# Altium project cansat_single_pair_ethernet.PrjPcb
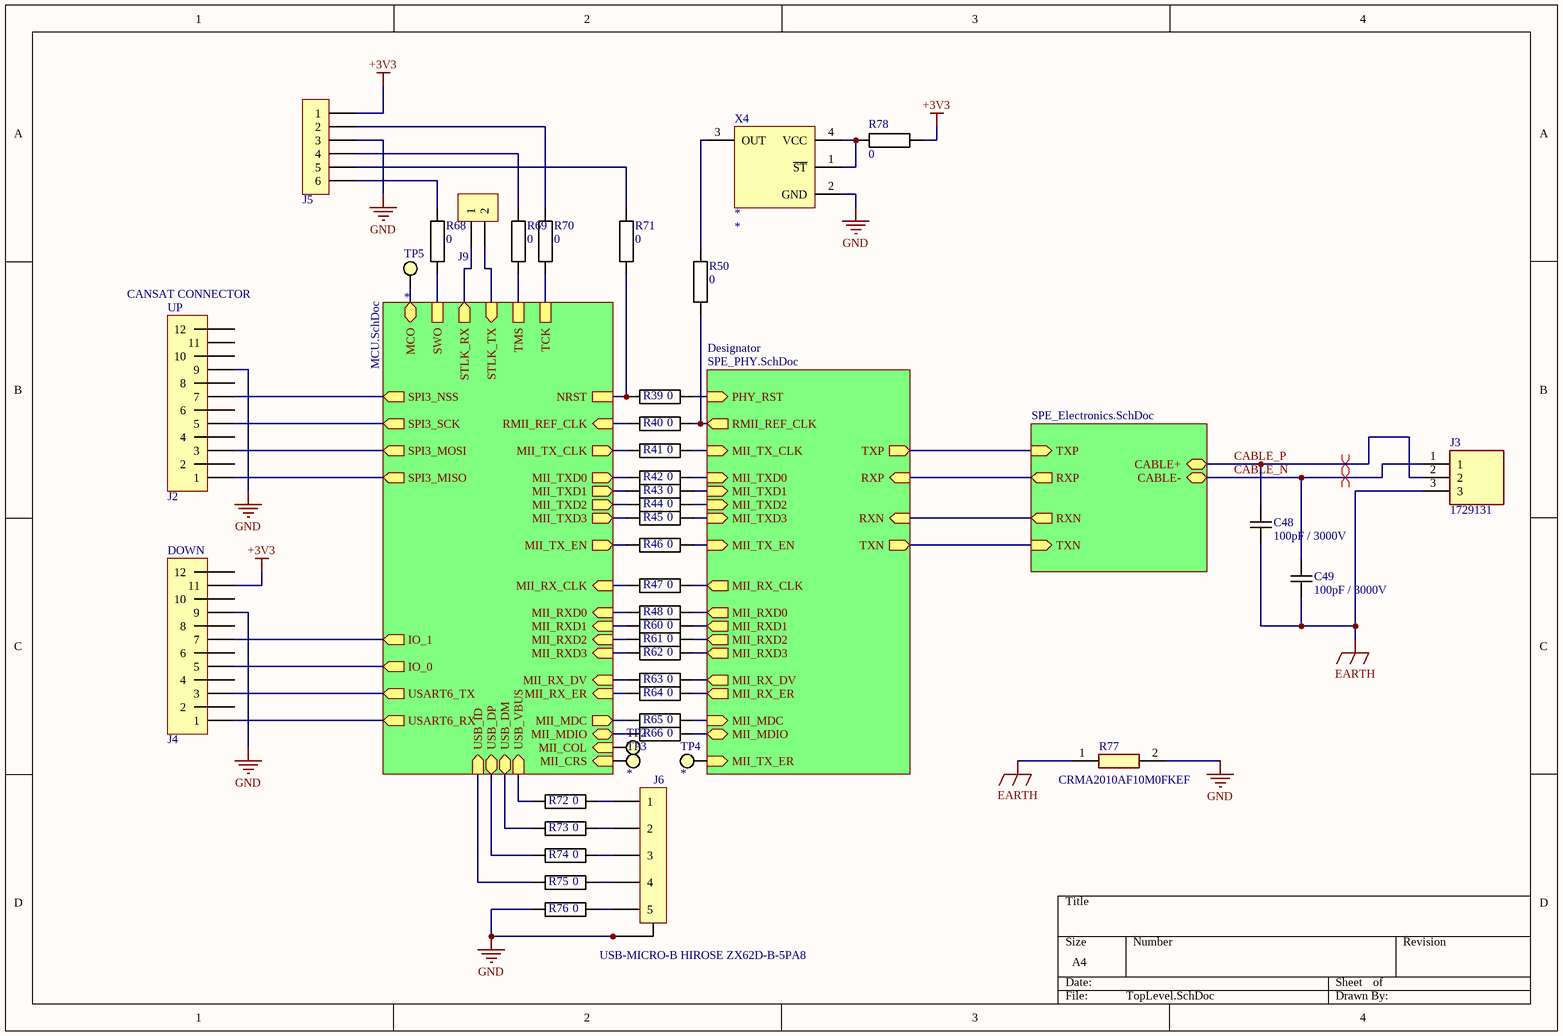
[diagram p0: TopLevel.SchDoc]
4 sheets, 147 parts. Net scope: hierarchical (ports join the sheet entries above them; power ports are global).
Board file: PCB.PcbDoc
Sheets:
  TopLevel.SchDoc
    Designator = MCU.SchDoc
    Designator = SPE_Electronics.SchDoc
    Designator = SPE_PHY.SchDoc

## Sheet TopLevel.SchDoc
size A4; SheetNumber: 1; SheetTotal: 5

### Parts
C48  100pF / 3000V  [CAPACITOR 4520 REFLOW]
C49  100pF / 3000V  [CAPACITOR 4520 REFLOW]
J2  *  [PINHEADER2X6 P2.54 SIDE MOUNT]  (value not drawn)
J3  1729131  [1729131]
J4  *  [PINHEADER2X6 P2.54 SIDE MOUNT]  (value not drawn)
J5  *  [PinHeader1x6 P2.54]  (value not drawn)
J6  USB-MICRO-B HIROSE ZX62D-B-5PA8  [USB-MICRO-B HIROSE ZX62D-B-5PA8]
J9  *  [PinHeader1x2 P2.54]  (value not drawn)
R39  0  [RESISTOR 1608 REFLOW]
R40  0  [RESISTOR 1608 REFLOW]
R41  0  [RESISTOR 1608 REFLOW]
R42  0  [RESISTOR 1608 REFLOW]
R43  0  [RESISTOR 1608 REFLOW]
R44  0  [RESISTOR 1608 REFLOW]
R45  0  [RESISTOR 1608 REFLOW]
R46  0  [RESISTOR 1608 REFLOW]
R47  0  [RESISTOR 1608 REFLOW]
R48  0  [RESISTOR 1608 REFLOW]
R50  0  [RESISTOR 1608 REFLOW]
R60  0  [RESISTOR 1608 REFLOW]
R61  0  [RESISTOR 1608 REFLOW]
R62  0  [RESISTOR 1608 REFLOW]
R63  0  [RESISTOR 1608 REFLOW]
R64  0  [RESISTOR 1608 REFLOW]
R65  0  [RESISTOR 1608 REFLOW]
R66  0  [RESISTOR 1608 REFLOW]
R68  0  [RESISTOR 1608 REFLOW]
R69  0  [RESISTOR 1608 REFLOW]
R70  0  [RESISTOR 1608 REFLOW]
R71  0  [RESISTOR 1608 REFLOW]
R72  0  [RESISTOR 1005 REFLOW]
R73  0  [RESISTOR 1005 REFLOW]
R74  0  [RESISTOR 1005 REFLOW]
R75  0  [RESISTOR 1005 REFLOW]
R76  0  [RESISTOR 1005 REFLOW]
R77  CRMA2010AF10M0FKEF  [RESC5125X74N]
R78  0  [RESISTOR 1608 REFLOW]
TP2  *  [Pad D0.8]  (no BOM)
TP3  *  [Pad D0.8]  (no BOM)
TP4  *  [Pad D0.8]  (no BOM)
TP5  *  [Pad D0.8]  (no BOM)
X4  *  [Oscillator C2.5x2 Seiko Epson SPXO SG-210STF]

### Sub-sheets
Designator = MCU.SchDoc: NRST, USB_DM (bidir), TCK, RMII_REF_CLK (in), USB_VBUS (in), USB_ID (in), USART6_TX (out), TMS, STLK_TX (in), USB_DP (bidir), STLK_RX (out), SWO, USART6_RX (out), MCO (bidir), MII_TX_EN (out), MII_TX_CLK (out), MII_TXD3 (out), MII_RX_ER (in), MII_RXD0 (in), MII_RXD3 (in), MII_CRS (in), MII_RX_CLK (in), MII_RXD1 (in), MII_RX_DV (in), MII_MDIO (bidir), MII_TXD2 (out), MII_TXD0 (out), MII_MDC (out), MII_RXD2 (in), MII_TXD1 (out), MII_COL (in), SPI3_SCK (out), SPI3_MOSI (out), SPI3_NSS (out), IO_1 (out), IO_0 (out), SPI3_MISO (out)
Designator = SPE_Electronics.SchDoc: RXP (out), TXN (in), CABLE+ (bidir), CABLE- (bidir), TXP (in), RXN (out)
Designator = SPE_PHY.SchDoc: RXN (in), TXP (out), PHY_RST (in), RMII_REF_CLK (out), RXP (in), TXN (out), MII_RXD1 (out), MII_TX_ER (in), MII_RX_ER (out), MII_TX_CLK (in), MII_RXD3 (out), MII_MDIO (bidir), MII_TXD1 (in), MII_RX_DV (out), MII_TX_EN (in), MII_MDC (in), MII_RX_CLK (out), MII_RXD0 (out), MII_RXD2 (out), MII_TXD0 (in), MII_TXD3 (in), MII_TXD2 (in)

### Nets
+3V3: J4.11 J5.1 R78.2
EARTH: C48.2 C49.2 J3.3 R77.1
GND: J2.9 J4.9 J5.3 J6.6 J6.7 J6.8 J6.9 R76.2 R77.2 X4.2(GND)
CABLE_N: C49.1 J3.1 ; sheet Designator/CABLE-
CABLE_P: C48.1 J3.2 ; sheet Designator/CABLE+
NRST: R39.2 R71.2 ; sheet Designator/NRST
PA0: TP3.1 ; sheet Designator/MII_CRS
PA1: R40.2 ; sheet Designator/RMII_REF_CLK
PA2: R66.2 ; sheet Designator/MII_MDIO
PA3: TP2.1 ; sheet Designator/MII_COL
PA7: R63.2 ; sheet Designator/MII_RX_DV
PA10: R75.2 ; sheet Designator/USB_ID
PA11: R73.2 ; sheet Designator/USB_DM
PA12: R74.2 ; sheet Designator/USB_DP
PA13: R69.2 ; sheet Designator/TMS
PA14: R70.2 ; sheet Designator/TCK
PA15: J2.7 ; sheet Designator/SPI3_NSS
PB0: R61.2 ; sheet Designator/MII_RXD2
PB1: R62.2 ; sheet Designator/MII_RXD3
PB3: R68.2 ; sheet Designator/SWO
PB10: R64.2 ; sheet Designator/MII_RX_ER
PB13: R43.2 ; sheet Designator/MII_TXD1
PC1: R65.2 ; sheet Designator/MII_MDC
PC2: R44.2 ; sheet Designator/MII_TXD2
PC3: R41.2 ; sheet Designator/MII_TX_CLK
PC4: R48.2 ; sheet Designator/MII_RXD0
PC5: R60.2 ; sheet Designator/MII_RXD1
PC6: J4.3 ; sheet Designator/USART6_TX
PC7: J4.1 ; sheet Designator/USART6_RX
PC8: J4.5 ; sheet Designator/IO_0
PC9: J4.7 ; sheet Designator/IO_1
PC10: J2.5 ; sheet Designator/SPI3_SCK
PC11: J2.1 ; sheet Designator/SPI3_MISO
PC12: J2.3 ; sheet Designator/SPI3_MOSI
PD8: J9.1 ; sheet Designator/STLK_RX
PD9: J9.2 ; sheet Designator/STLK_TX
PE0: R45.2 ; sheet Designator/MII_TXD3
PG11: R46.2 ; sheet Designator/MII_TX_EN
PG13: R42.2 ; sheet Designator/MII_TXD0
RX_CLK: R47.1 ; sheet Designator/MII_RX_CLK
RX_DV: R63.1 ; sheet Designator/MII_RX_DV
RX_ER: R64.1 ; sheet Designator/MII_RX_ER
RXD_0: R48.1 ; sheet Designator/MII_RXD0
RXD_1: R60.1 ; sheet Designator/MII_RXD1
RXD_2: R61.1 ; sheet Designator/MII_RXD2
RXD_3: R62.1 ; sheet Designator/MII_RXD3
RXN: sheet Designator/RXN, sheet Designator/RXN
RXP: sheet Designator/RXP, sheet Designator/RXP
TXD_3: R45.1 ; sheet Designator/MII_TXD3
TXN: sheet Designator/TXN, sheet Designator/TXN
TXP: sheet Designator/TXP, sheet Designator/TXP
NetIC3_1: R44.1 ; sheet Designator/MII_TXD2
NetIC3_5: R39.1 ; sheet Designator/PHY_RST
NetIC3_7: R40.1 R50.2 ; sheet Designator/RMII_REF_CLK
NetIC3_26: R66.1 ; sheet Designator/MII_MDIO
NetIC3_27: R65.1 ; sheet Designator/MII_MDC
NetIC3_36: TP4.1 ; sheet Designator/MII_TX_ER
NetIC3_37: R46.1 ; sheet Designator/MII_TX_EN
NetIC3_38: R41.1 ; sheet Designator/MII_TX_CLK
NetIC3_39: R42.1 ; sheet Designator/MII_TXD0
NetIC3_40: R43.1 ; sheet Designator/MII_TXD1
NetJ5_2: J5.2 R70.1
NetJ5_4: J5.4 R69.1
NetJ5_5: J5.5 R71.1
NetJ5_6: J5.6 R68.1
NetJ6_1: J6.1 R72.1
NetJ6_2: J6.2 R73.1
NetJ6_3: J6.3 R74.1
NetJ6_4: J6.4 R75.1
NetJ6_5: J6.5 R76.1
NetR6_2: R72.2 ; sheet Designator/USB_VBUS
NetR47_2: R47.2 ; sheet Designator/MII_RX_CLK
NetR49_1: TP5.1 ; sheet Designator/MCO
NetR50_1: R50.1 X4.3(OUT)
NetR78_1: R78.1 X4.1(~{ST}) X4.4(VCC)

Not connected (* = marked no-connect by the designer): J2 2 4 6 8 10 11 12; J4 2 4 6 8 10 12

### Layout directives
differential pair: CABLE_N, CABLE_P

### Notes on the sheet
- (near J2) CANSAT CONNECTOR
- (near J2) UP
- (near J4) DOWN

### Library data of the parts
C48 C49 = Capacitor: Value: 100pF / 3000V
J2 J4 = PinHeader2x6: Plug connector; Value: *
J3 = 1729131: Connector; Manufacturer_Name: Phoenix Contact; Datasheet Link: http://www.phoenixcontact.com/de/produkte/1729131/pdf; Height: 10.15mm; Manufacturer_Part_Number: 1729131; Mouser Part Number: 651-1729131; Mouser Price/Stock: https://www.mouser.co.uk/ProductDetail/Phoenix-Contact/1729131?qs=GFUSqQMLmmkspw%2F%2FW6PC3g%3D%3D; Arrow Part Number: 1729131; Arrow Price/Stock: https://www.arrow.com/en/products/1729131/phoenix-contact
J5 = PinHeader1x6: Plug connector; Value: *
J9 = PinHeader1x2: Plug connector; Value: *
R39-R48 R50 R60-R66 R68-R76 R78 = Resistor: Value: 0
R77 = CRMA2010AF1K00FKEF: Resistor; Manufacturer_Name: Vishay; Datasheet Link: https://www.vishay.com/docs/68043/crma.pdf; Height: 0.74mm; Manufacturer_Part_Number: CRMA2010AF1K00FKEF; Mouser Part Number: 71-CRMA2010AF1K00FKF; Mouser Price/Stock: https://www.mouser.co.uk/ProductDetail/Vishay-Techno/CRMA2010AF1K00FKEF?qs=1mbolxNpo8fLEeNjiEgpoA%3D%3D; Arrow Part Number: CRMA2010AF1K00FKEF; Arrow Price/Stock: https://www.arrow.com/en/products/crma2010af1k00fkef/vishay
TP2-TP5 = Pad: Value: *
X4 = Oscillator C2.5x2.0 Seiko Epson SPXO SG-210STF: Oscillator C2.5x2 Seiko Epson SPXO SG-210STF; Value: *

## Sheet MCU.SchDoc
size A3; SheetNumber: 3; SheetTotal: 5
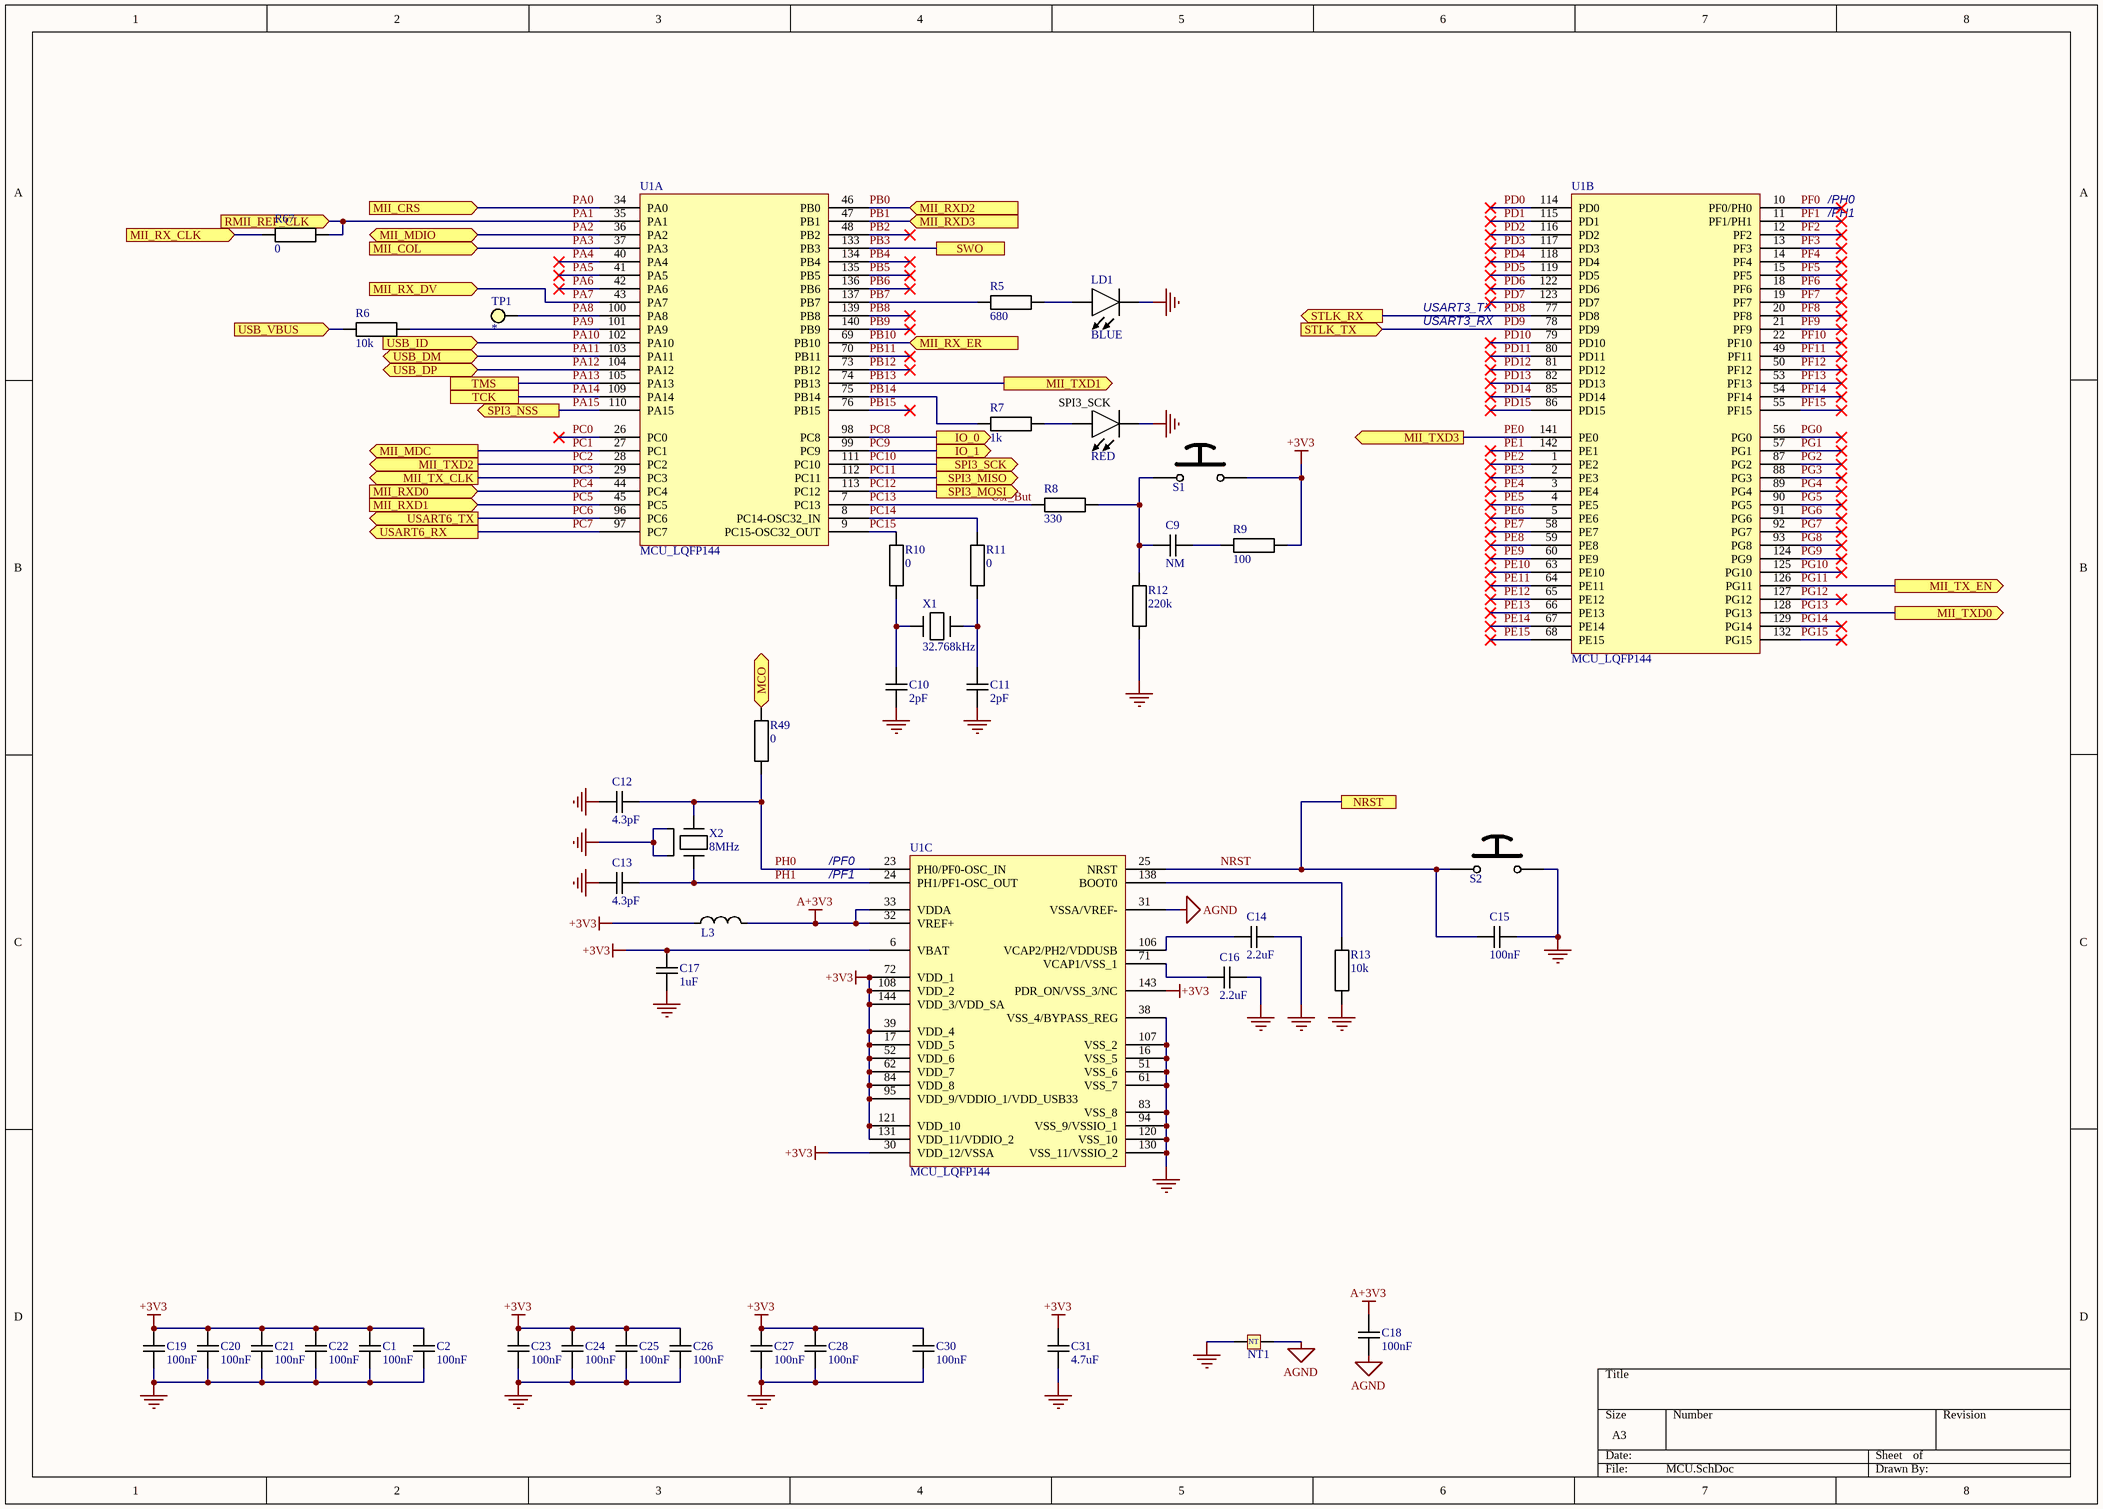
[diagram p1: MCU.SchDoc]

### Parts
C1  100nF  [CAPACITOR 1608 REFLOW]
C2  100nF  [CAPACITOR 1608 REFLOW]
C9  NM  [CAPACITOR 1608 REFLOW]
C10  2pF  [CAPACITOR 1608 REFLOW]
C11  2pF  [CAPACITOR 1608 REFLOW]
C12  4.3pF  [CAPACITOR 1608 REFLOW]
C13  4.3pF  [CAPACITOR 1608 REFLOW]
C14  2.2uF  [CAPACITOR 1608 REFLOW]
C15  100nF  [CAPACITOR 1608 REFLOW]
C16  2.2uF  [CAPACITOR 1608 REFLOW]
C17  1uF  [CAPACITOR 1608 REFLOW]
C18  100nF  [CAPACITOR 1608 REFLOW]
C19  100nF  [CAPACITOR 1608 REFLOW]
C20  100nF  [CAPACITOR 1608 REFLOW]
C21  100nF  [CAPACITOR 1608 REFLOW]
C22  100nF  [CAPACITOR 1608 REFLOW]
C23  100nF  [CAPACITOR 1608 REFLOW]
C24  100nF  [CAPACITOR 1608 REFLOW]
C25  100nF  [CAPACITOR 1608 REFLOW]
C26  100nF  [CAPACITOR 1608 REFLOW]
C27  100nF  [CAPACITOR 1608 REFLOW]
C28  100nF  [CAPACITOR 1608 REFLOW]
C30  100nF  [CAPACITOR 1608 REFLOW]
C31  4.7uF  [CAPACITOR 1608 REFLOW]
L3  *  [INDUCTOR 1608 REFLOW]  (value not drawn)
LD1  BLUE  [LED 1608 REFLOW]
LD2  RED  [LED 1608 REFLOW]
NT1  Net Tie  [NET TIE 1005]  (value not drawn)  (net tie, no BOM)
R5  680  [RESISTOR 1608 REFLOW]
R6  10k  [RESISTOR 1608 REFLOW]
R7  1k  [RESISTOR 1608 REFLOW]
R8  330  [RESISTOR 1608 REFLOW]
R9  100  [RESISTOR 1608 REFLOW]
R10  0  [RESISTOR 1608 REFLOW]
R11  0  [RESISTOR 1608 REFLOW]
R12  220k  [RESISTOR 1608 REFLOW]
R13  10k  [RESISTOR 1608 REFLOW]
R49  0  [RESISTOR 1608 REFLOW]
R67  0  [RESISTOR 1608 REFLOW]
S1  *  [Push Button C2.5X3.0 OMRON B3U-1000P(M)-B]  (value not drawn)
S2  *  [Push Button C2.5X3.0 OMRON B3U-1000P(M)-B]  (value not drawn)
TP1  *  [Pad D0.8]  (no BOM)
U1  MCU_LQFP144  [LQFP144 P0.5 C20.0x20.0 H1.6]  (parts A,B,C of 3)
X1  32.768kHz  [Crystal C2.0x1.2 CTS TF20]
X2  8MHz  [Crystal C2.0x1.6 Abracon ABM11W]

### Ports
IO_0 (out), IO_1 (out), MCO (bidir), MII_COL (in), MII_CRS (in), MII_MDC (out), MII_MDIO (bidir), MII_RX_CLK (in), MII_RX_DV (in), MII_RX_ER (in), MII_RXD0 (in), MII_RXD1 (in), MII_RXD2 (in), MII_RXD3 (in), MII_TX_CLK (out), MII_TX_EN (out), MII_TXD0 (out), MII_TXD1 (out), MII_TXD2 (out), MII_TXD3 (out), NRST, RMII_REF_CLK (in), SPI3_MISO (out), SPI3_MOSI (out), SPI3_NSS (out), SPI3_SCK (out), STLK_RX (out), STLK_TX (in), SWO, TCK, TMS, USART6_RX (out), USART6_TX (out), USB_DM (bidir), USB_DP (bidir), USB_ID (in), USB_VBUS (in)

### Nets
+3V3: C1.1 C2.1 C17.2 C19.1 C20.1 C21.1 C22.1 C23.1 C24.1 C25.1 C26.1 C27.1 C28.1 C30.1 C31.1 L3.1 R9.2 S1.2 U1.6(VBAT) U1.17(VDD_5) U1.30(VDD_12/VSSA) U1.39(VDD_4) U1.52(VDD_6) U1.62(VDD_7) U1.72(VDD_1) U1.84(VDD_8) U1.95(VDD_9/VDDIO_1/VDD_USB33) U1.108(VDD_2) U1.121(VDD_10) U1.131(VDD_11/VDDIO_2) U1.143(PDR_ON/VSS_3/NC) U1.144(VDD_3/VDD_SA)
A+3V3: C18.1 L3.2 U1.32(VREF+) U1.33(VDDA)
AGND: C18.2 NT1.2 U1.31(VSSA/VREF-)
GND: C1.2 C2.2 C10.1 C11.1 C12.2 C13.2 C14.2 C15.1 C16.2 C17.1 C19.2 C20.2 C21.2 C22.2 C23.2 C24.2 C25.2 C26.2 C27.2 C28.2 C30.2 C31.2 LD1.1(C) LD2.1(C) NT1.1 R12.2 R13.2 S2.2 U1.16(VSS_5) U1.38(VSS_4/BYPASS_REG) U1.51(VSS_6) U1.61(VSS_7) U1.83(VSS_8) U1.94(VSS_9/VSSIO_1) U1.107(VSS_2) U1.120(VSS_10) U1.130(VSS_11/VSSIO_2) X2.2 X2.4
NRST: C15.2 S2.1 U1.25(NRST) ; port NRST
PA0: U1.34(PA0) ; port MII_CRS
PA1: R67.2 U1.35(PA1) ; port RMII_REF_CLK
PA2: U1.36(PA2) ; port MII_MDIO
PA3: U1.37(PA3) ; port MII_COL
PA4: U1.40(PA4)
PA5: U1.41(PA5)
PA6: U1.42(PA6)
PA7: U1.43(PA7) ; port MII_RX_DV
PA8: TP1.1 U1.100(PA8)
PA9: R6.1 U1.101(PA9)
PA10: U1.102(PA10) ; port USB_ID
PA11: U1.103(PA11) ; port USB_DM
PA12: U1.104(PA12) ; port USB_DP
PA13: U1.105(PA13) ; port TMS
PA14: U1.109(PA14) ; port TCK
PA15: U1.110(PA15) ; port SPI3_NSS
PB0: U1.46(PB0) ; port MII_RXD2
PB1: U1.47(PB1) ; port MII_RXD3
PB2: U1.48(PB2)
PB3: U1.133(PB3) ; port SWO
PB4: U1.134(PB4)
PB5: U1.135(PB5)
PB6: U1.136(PB6)
PB7: R5.2 U1.137(PB7)
PB8: U1.139(PB8)
PB9: U1.140(PB9)
PB10: U1.69(PB10) ; port MII_RX_ER
PB11: U1.70(PB11)
PB12: U1.73(PB12)
PB13: U1.74(PB13) ; port MII_TXD1
PB14: R7.2 U1.75(PB14)
PB15: U1.76(PB15)
PC0: U1.26(PC0)
PC1: U1.27(PC1) ; port MII_MDC
PC2: U1.28(PC2) ; port MII_TXD2
PC3: U1.29(PC3) ; port MII_TX_CLK
PC4: U1.44(PC4) ; port MII_RXD0
PC5: U1.45(PC5) ; port MII_RXD1
PC6: U1.96(PC6) ; port USART6_TX
PC7: U1.97(PC7) ; port USART6_RX
PC8: U1.98(PC8) ; port IO_0
PC9: U1.99(PC9) ; port IO_1
PC10: U1.111(PC10) ; port SPI3_SCK
PC11: U1.112(PC11) ; port SPI3_MISO
PC12: U1.113(PC12) ; port SPI3_MOSI
PC13: R8.1 U1.7(PC13)  [also labelled Usr_But]
PC14: R11.2 U1.8(PC14-OSC32_IN)
PC15: R10.1 U1.9(PC15-OSC32_OUT)
PD0: U1.114(PD0)
PD1: U1.115(PD1)
PD2: U1.116(PD2)
PD3: U1.117(PD3)
PD4: U1.118(PD4)
PD5: U1.119(PD5)
PD6: U1.122(PD6)
PD7: U1.123(PD7)
PD8: U1.77(PD8) ; port STLK_RX
PD9: U1.78(PD9) ; port STLK_TX
PD10: U1.79(PD10)
PD11: U1.80(PD11)
PD12: U1.81(PD12)
PD13: U1.82(PD13)
PD14: U1.85(PD14)
PD15: U1.86(PD15)
PE0: U1.141(PE0) ; port MII_TXD3
PE1: U1.142(PE1)
PE2: U1.1(PE2)
PE3: U1.2(PE3)
PE4: U1.3(PE4)
PE5: U1.4(PE5)
PE6: U1.5(PE6)
PE7: U1.58(PE7)
PE8: U1.59(PE8)
PE9: U1.60(PE9)
PE10: U1.63(PE10)
PE11: U1.64(PE11)
PE12: U1.65(PE12)
PE13: U1.66(PE13)
PE14: U1.67(PE14)
PE15: U1.68(PE15)
PF0: U1.10(PF0/PH0)
PF1: U1.11(PF1/PH1)
PF2: U1.12(PF2)
PF3: U1.13(PF3)
PF4: U1.14(PF4)
PF5: U1.15(PF5)
PF6: U1.18(PF6)
PF7: U1.19(PF7)
PF8: U1.20(PF8)
PF9: U1.21(PF9)
PF10: U1.22(PF10)
PF11: U1.49(PF11)
PF12: U1.50(PF12)
PF13: U1.53(PF13)
PF14: U1.54(PF14)
PF15: U1.55(PF15)
PG0: U1.56(PG0)
PG1: U1.57(PG1)
PG2: U1.87(PG2)
PG3: U1.88(PG3)
PG4: U1.89(PG4)
PG5: U1.90(PG5)
PG6: U1.91(PG6)
PG7: U1.92(PG7)
PG8: U1.93(PG8)
PG9: U1.124(PG9)
PG10: U1.125(PG10)
PG11: U1.126(PG11) ; port MII_TX_EN
PG12: U1.127(PG12)
PG13: U1.128(PG13) ; port MII_TXD0
PG14: U1.129(PG14)
PG15: U1.132(PG15)
PH0: C12.1 R49.2 U1.23(PH0/PF0-OSC_IN) X2.1
PH1: C13.1 U1.24(PH1/PF1-OSC_OUT) X2.3
NetC9_1: C9.1 R9.1
NetC9_2: C9.2 R8.2 R12.1 S1.1
NetC10_2: C10.2 R10.2 X1.1
NetC11_2: C11.2 R11.1 X1.2
NetC14_1: C14.1 U1.106(VCAP2/PH2/VDDUSB)
NetC16_1: C16.1 U1.71(VCAP1/VSS_1)
NetLD1_2: LD1.2(A) R5.1
NetLD2_2: LD2.2(A) R7.1
NetR6_2: R6.2 ; port USB_VBUS
NetR13_1: R13.1 U1.138(BOOT0)
NetR47_2: R67.1 ; port MII_RX_CLK
NetR49_1: R49.1 ; port MCO

### Notes on the sheet
- /PH0
- /PH1
- USART3_TX
- USART3_RX
- (near LD2) SPI3_SCK
- /PF0
- /PF1
- (in symbol Net Tie) NT

### Library data of the parts
C1 C2 C9-C28 C30 C31 = Capacitor
  C1 C2 C15 C18-C28 C30: Value: 100nF
  C9: Value: NM
  C10 C11: Value: 2pF
  C12 C13: Value: 4.3pF
  C14 C16: Value: 2.2uF
  C17: Value: 1uF
  C31: Value: 4.7uF
L3 = Inductor: Value: *
LD1 LD2 = LED: LED generic
  LD1: Value: BLUE
  LD2: Value: RED
NT1 = Net Tie: Connection for 2 different NETNAME
R5-R13 R49 R67 = Resistor
  R5: Value: 680
  R6 R13: Value: 10k
  R7: Value: 1k
  R8: Value: 330
  R9: Value: 100
  R10 R11 R49 R67: Value: 0
  R12: Value: 220k
S1 S2 = Push Button 2Pins: Push Button, 2 pins; Value: *
TP1 = Pad: Value: *
X1 = Crystal C2.0x1.2 CTS TF20: Value: 32.768kHz
X2 = Crystal C2.0x1.6 Abracon ABM11W: Value: 8MHz

## Sheet SPE_Electronics.SchDoc
size A4; SheetNumber: 5; SheetTotal: 5
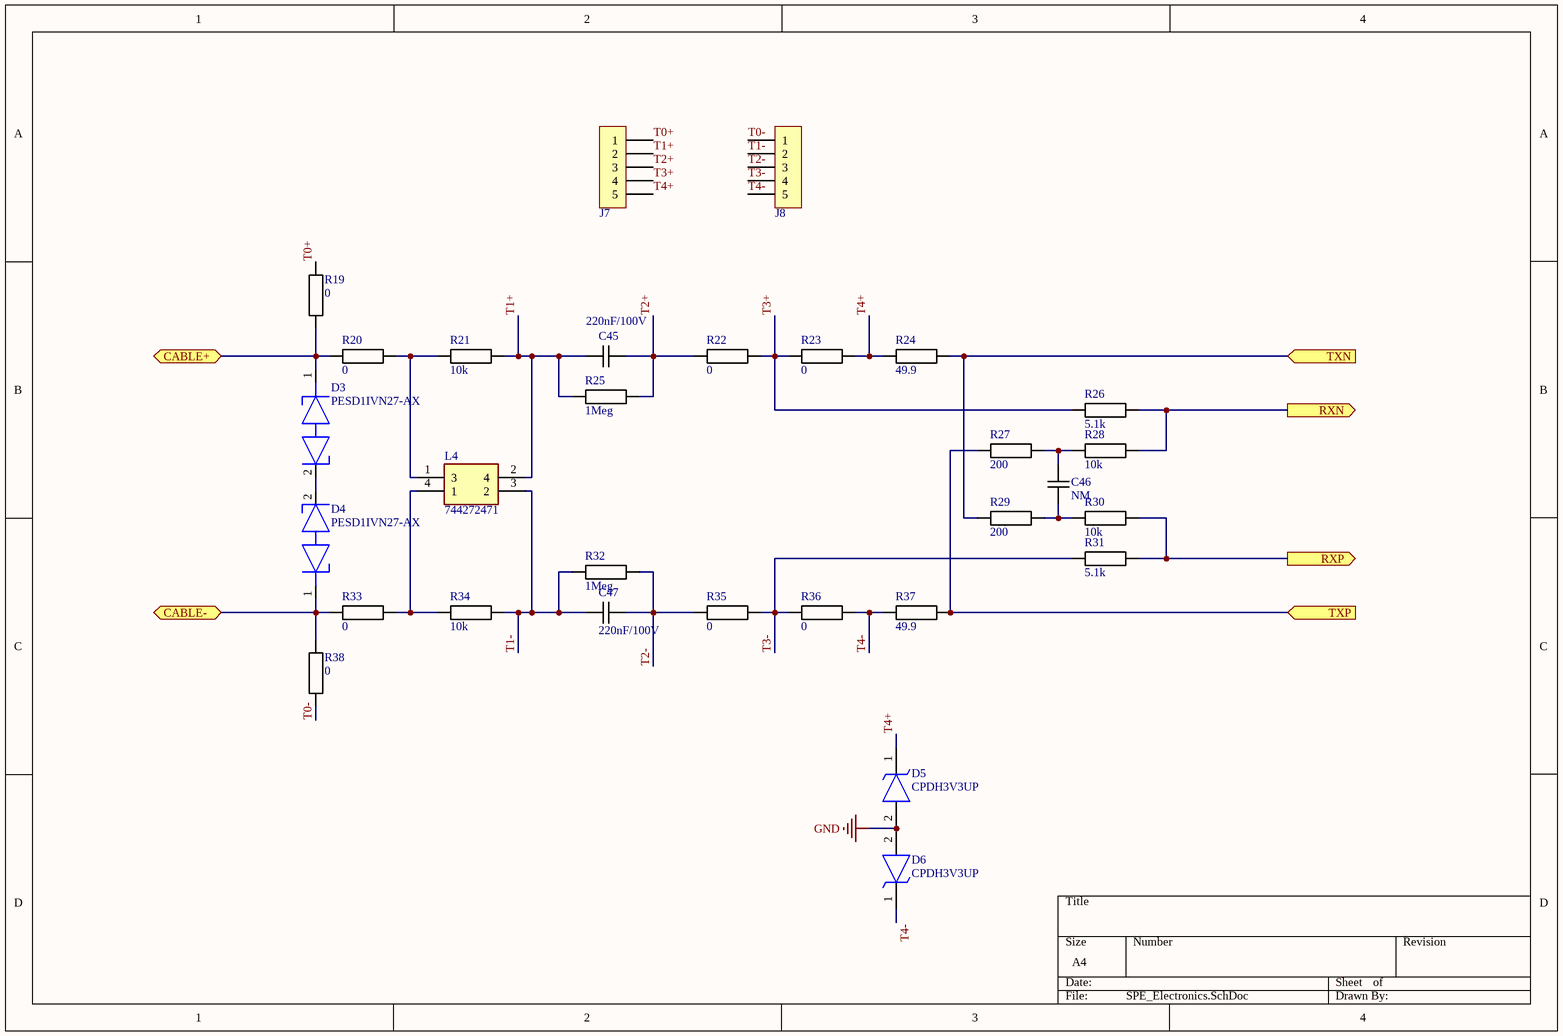
[diagram p2: SPE_Electronics.SchDoc]

### Parts
C45  220nF/100V  [CAPACITOR 1608 REFLOW]
C46  NM  [CAPACITOR 1608 REFLOW]
C47  220nF/100V  [CAPACITOR 1608 REFLOW]
D3  PESD1IVN27-AX  [PESD1IVN27AX]
D4  PESD1IVN27-AX  [PESD1IVN27AX]
D5  CPDH3V3UP  [CPDH3V3UP]
D6  CPDH3V3UP  [CPDH3V3UP]
J7  *  [PinHeader1x5 P2.54]  (value not drawn)
J8  *  [PinHeader1x5 P2.54]  (value not drawn)
L4  744272471  [WE-SL575]
R19  0  [RESISTOR 1608 REFLOW]
R20  0  [RESISTOR 1608 REFLOW]
R21  10k  [RESISTOR 1608 REFLOW]
R22  0  [RESISTOR 1608 REFLOW]
R23  0  [RESISTOR 1608 REFLOW]
R24  49.9  [RESISTOR 1608 REFLOW]
R25  1Meg  [RESISTOR 1608 REFLOW]
R26  5.1k  [RESISTOR 1608 REFLOW]
R27  200  [RESISTOR 1608 REFLOW]
R28  10k  [RESISTOR 1608 REFLOW]
R29  200  [RESISTOR 1608 REFLOW]
R30  10k  [RESISTOR 1608 REFLOW]
R31  5.1k  [RESISTOR 1608 REFLOW]
R32  1Meg  [RESISTOR 1608 REFLOW]
R33  0  [RESISTOR 1608 REFLOW]
R34  10k  [RESISTOR 1608 REFLOW]
R35  0  [RESISTOR 1608 REFLOW]
R36  0  [RESISTOR 1608 REFLOW]
R37  49.9  [RESISTOR 1608 REFLOW]
R38  0  [RESISTOR 1608 REFLOW]

### Ports
CABLE+ (bidir), CABLE- (bidir), RXN (out), RXP (out), TXN (in), TXP (in)

### Nets
GND: D5.2(A) D6.2(A)
CABLE_N: D4.1(K1) R33.2 R38.2 ; port CABLE-
CABLE_P: D3.1(K1) R19.2 R20.2 ; port CABLE+
RXN: R26.1 R28.1 ; port RXN
RXP: R30.1 R31.1 ; port RXP
T0+: J7.1 R19.1
T0-: J8.1 R38.1
T1+: C45.2 J7.2 L4.2(4) R21.1 R25.2
T1-: C47.2 J8.2 L4.3(2) R32.2 R34.1
T2+: C45.1 J7.3 R22.2 R25.1
T2-: C47.1 J8.3 R32.1 R35.2
T3+: J7.4 R22.1 R23.2 R26.2
T3-: J8.4 R31.2 R35.1 R36.2
T4+: D5.1(K) J7.5 R23.1 R24.2
T4-: D6.1(K) J8.5 R36.1 R37.2
TXN: R24.1 R29.2 ; port TXN
TXP: R27.2 R37.1 ; port TXP
NetC46_1: C46.1 R29.1 R30.2
NetC46_2: C46.2 R27.1 R28.2
NetD3_2: D3.2(K2) D4.2(K2)
NetL4_1: L4.1(3) R20.1 R21.2
NetL4_4: L4.4(1) R33.1 R34.2

### Library data of the parts
C45-C47 = Capacitor
  C45 C47: Value: 220nF/100V
  C46: Value: NM
D3 D4 = PESD1IVN27-AX: Diode ESD (Bi-directional); Manufacturer_Name: Nexperia; Datasheet Link: https://assets.nexperia.com/documents/data-sheet/PESD1IVN27-A.pdf; Height: 1.1mm; Manufacturer_Part_Number: PESD1IVN27-AX; Mouser Part Number: 771-PESD1IVN27-AX; Mouser Price/Stock: https://www.mouser.co.uk/ProductDetail/Nexperia/PESD1IVN27-AX?qs=0lQeLiL1qyYTtxrCfdJstQ%3D%3D; Arrow Part Number: PESD1IVN27-AX; Arrow Price/Stock: https://www.arrow.com/en/products/pesd1ivn27-ax/nexperia
D5 D6 = CPDH3V3UP: TVS Diode (Uni-directional); Manufacturer_Name: Comchip Technology; Datasheet Link: https://datasheet.datasheetarchive.com/originals/distributors/Datasheets-DGA26/1846145.pdf; Height: 0.77mm; Manufacturer_Part_Number: CPDH3V3UP; Mouser Part Number: 750-CPDH3V3UP; Mouser Price/Stock: https://www.mouser.co.uk/ProductDetail/Comchip-Technology/CPDH3V3UP?qs=tw%252BuQ%2FB6PO1cIMMFw61gpA%3D%3D; Arrow Part Number: CPDH3V3UP; Arrow Price/Stock: https://www.arrow.com/en/products/cpdh3v3up/comchip-technology
J7 J8 = PinHeader1x5: Plug connector; Value: *
L4 = 744272471: Inductor; Manufacturer_Name: Wurth Elektronik; Manufacturer_Part_Number: 744272471; Mouser Part Number: 710-744272471; Mouser Price/Stock: https://www.mouser.co.uk/ProductDetail/Wurth-Elektronik/744272471?qs=PGXP4M47uW4cnUBvOIMCOQ%3D%3D
R19-R38 = Resistor
  R19 R20 R22 R23 R33 R35 R36 R38: Value: 0
  R21 R28 R30 R34: Value: 10k
  R24 R37: Value: 49.9
  R25 R32: Value: 1Meg
  R26 R31: Value: 5.1k
  R27 R29: Value: 200

## Sheet SPE_PHY.SchDoc
size A4; SheetNumber: 4; SheetTotal: 5
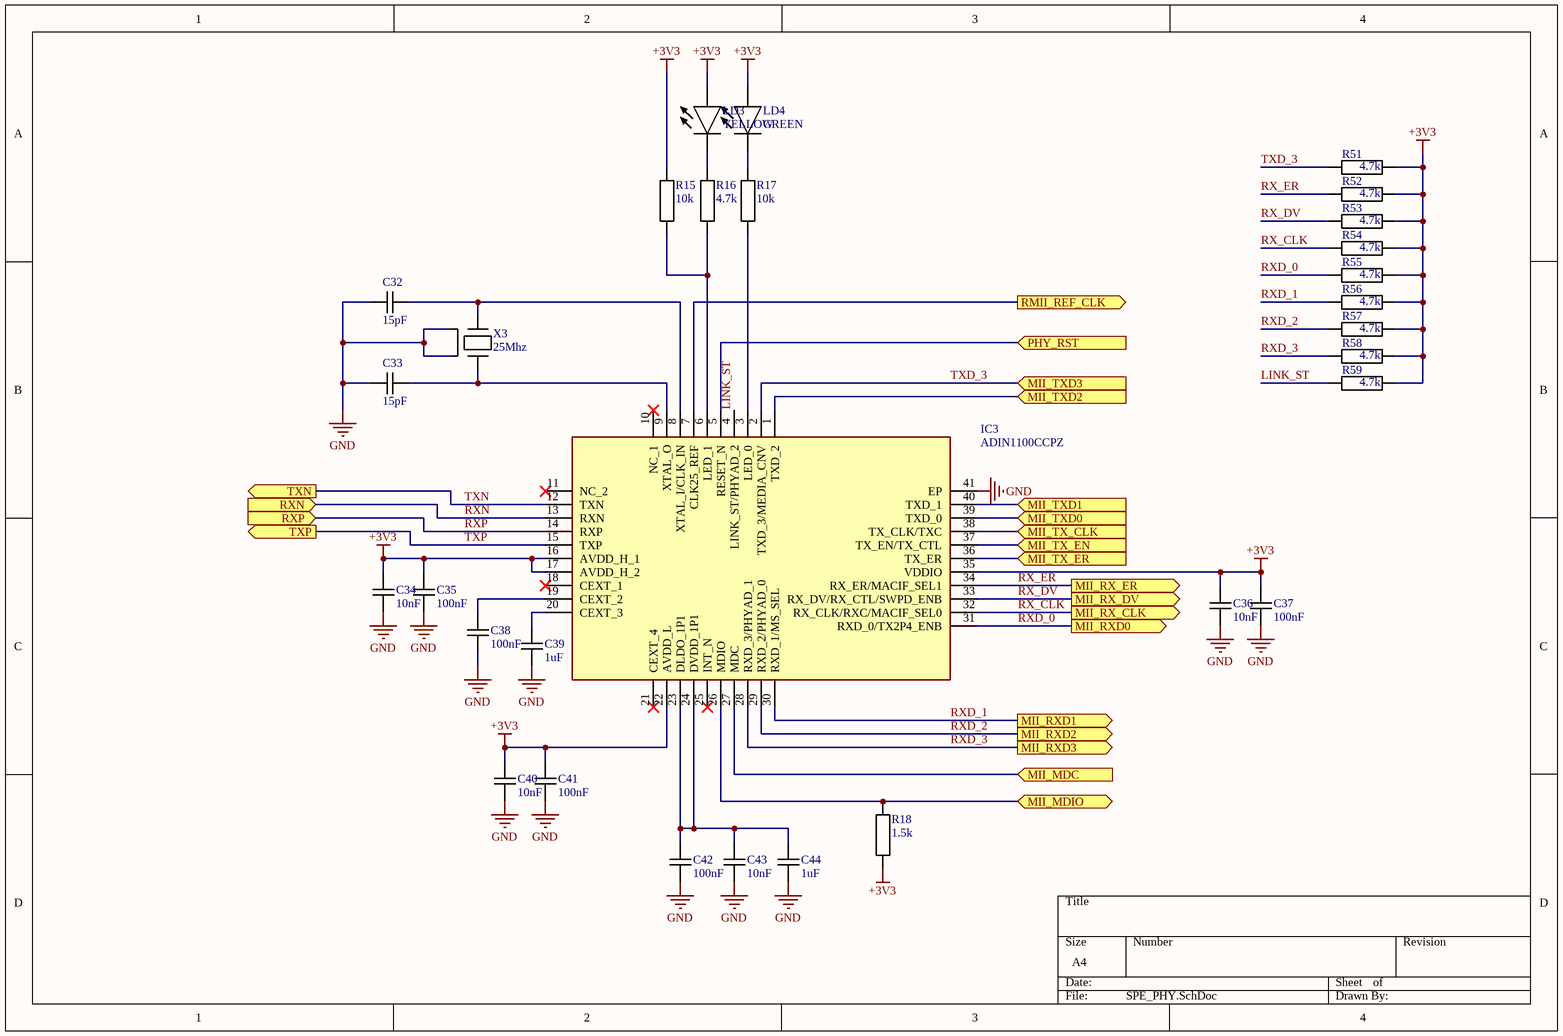
[diagram p3: SPE_PHY.SchDoc]

### Parts
C32  15pF  [CAPACITOR 1608 REFLOW]
C33  15pF  [CAPACITOR 1608 REFLOW]
C34  10nF  [CAPACITOR 1608 REFLOW]
C35  100nF  [CAPACITOR 1608 REFLOW]
C36  10nF  [CAPACITOR 1608 REFLOW]
C37  100nF  [CAPACITOR 1608 REFLOW]
C38  100nF  [CAPACITOR 1608 REFLOW]
C39  1uF  [CAPACITOR 1608 REFLOW]
C40  10nF  [CAPACITOR 1608 REFLOW]
C41  100nF  [CAPACITOR 1608 REFLOW]
C42  100nF  [CAPACITOR 1608 REFLOW]
C43  10nF  [CAPACITOR 1608 REFLOW]
C44  1uF  [CAPACITOR 1608 REFLOW]
IC3  ADIN1100CCPZ  [QFN50P600X600X80-41N-D]
LD3  YELLOW  [LED 1608 REFLOW]
LD4  GREEN  [LED 1608 REFLOW]
R15  10k  [RESISTOR 1608 REFLOW]
R16  4.7k  [RESISTOR 1608 REFLOW]
R17  10k  [RESISTOR 1608 REFLOW]
R18  1.5k  [RESISTOR 1608 REFLOW]
R51  4.7k  [RESISTOR 1608 REFLOW]
R52  4.7k  [RESISTOR 1608 REFLOW]
R53  4.7k  [RESISTOR 1608 REFLOW]
R54  4.7k  [RESISTOR 1608 REFLOW]
R55  4.7k  [RESISTOR 1608 REFLOW]
R56  4.7k  [RESISTOR 1608 REFLOW]
R57  4.7k  [RESISTOR 1608 REFLOW]
R58  4.7k  [RESISTOR 1608 REFLOW]
R59  4.7k  [RESISTOR 1608 REFLOW]
X3  25Mhz  [Crystal C2.5x2 Seiko Epson FA-128]

### Ports
MII_MDC (in), MII_MDIO (bidir), MII_RX_CLK (out), MII_RX_DV (out), MII_RX_ER (out), MII_RXD0 (out), MII_RXD1 (out), MII_RXD2 (out), MII_RXD3 (out), MII_TX_CLK (in), MII_TX_EN (in), MII_TX_ER (in), MII_TXD0 (in), MII_TXD1 (in), MII_TXD2 (in), MII_TXD3 (in), PHY_RST (in), RMII_REF_CLK (out), RXN (in), RXP (in), TXN (out), TXP (out)

### Nets
+3V3: C34.2 C35.2 C36.2 C37.2 C40.2 C41.2 IC3.16(AVDD_H_1) IC3.17(AVDD_H_2) IC3.22(AVDD_L) IC3.35(VDDIO) LD3.2(A) LD4.2(A) R15.2 R18.1 R51.1 R52.1 R53.1 R54.1 R55.1 R56.1 R57.1 R58.1 R59.1
GND: C32.2 C33.2 C34.1 C35.1 C36.1 C37.1 C38.1 C39.1 C40.1 C41.1 C42.1 C43.1 C44.1 IC3.41(EP) X3.2 X3.4
LINK_ST: IC3.4(LINK_ST/PHYAD_2) R59.2
RX_CLK: IC3.32(RX_CLK/RXC/MACIF_SEL0) R54.2 ; port MII_RX_CLK
RX_DV: IC3.33(RX_DV/RX_CTL/SWPD_ENB) R53.2 ; port MII_RX_DV
RX_ER: IC3.34(RX_ER/MACIF_SEL1) R52.2 ; port MII_RX_ER
RXD_0: IC3.31(RXD_0/TX2P4_ENB) R55.2 ; port MII_RXD0
RXD_1: IC3.30(RXD_1/MS_SEL) R56.2 ; port MII_RXD1
RXD_2: IC3.29(RXD_2/PHYAD_0) R57.2 ; port MII_RXD2
RXD_3: IC3.28(RXD_3/PHYAD_1) R58.2 ; port MII_RXD3
RXN: IC3.13(RXN) ; port RXN
RXP: IC3.14(RXP) ; port RXP
TXD_3: IC3.2(TXD_3/MEDIA_CNV) R51.2 ; port MII_TXD3
TXN: IC3.12(TXN) ; port TXN
TXP: IC3.15(TXP) ; port TXP
NetC32_1: C32.1 IC3.8(XTAL_I/CLK_IN) X3.1
NetC33_1: C33.1 IC3.9(XTAL_O) X3.3
NetC38_2: C38.2 IC3.19(CEXT_2)
NetC39_2: C39.2 IC3.20(CEXT_3)
NetC42_2: C42.2 C43.2 C44.2 IC3.23(DLDO_1P1) IC3.24(DVDD_1P1)
NetIC3_1: IC3.1(TXD_2) ; port MII_TXD2
NetIC3_3: IC3.3(LED_0) R17.1
NetIC3_5: IC3.5(RESET_N) ; port PHY_RST
NetIC3_6: IC3.6(LED_1) R15.1 R16.1
NetIC3_7: IC3.7(CLK25_REF) ; port RMII_REF_CLK
NetIC3_26: IC3.26(MDIO) R18.2 ; port MII_MDIO
NetIC3_27: IC3.27(MDC) ; port MII_MDC
NetIC3_36: IC3.36(TX_ER) ; port MII_TX_ER
NetIC3_37: IC3.37(TX_EN/TX_CTL) ; port MII_TX_EN
NetIC3_38: IC3.38(TX_CLK/TXC) ; port MII_TX_CLK
NetIC3_39: IC3.39(TXD_0) ; port MII_TXD0
NetIC3_40: IC3.40(TXD_1) ; port MII_TXD1
NetLD3_1: LD3.1(C) R16.2
NetLD4_1: LD4.1(C) R17.2

Not connected (* = marked no-connect by the designer): IC3 10(NC_1)* 11(NC_2)* 18(CEXT_1)* 21(CEXT_4)* 25(INT_N)*

### Library data of the parts
C32-C44 = Capacitor
  C32 C33: Value: 15pF
  C34 C36 C40 C43: Value: 10nF
  C35 C37 C38 C41 C42: Value: 100nF
  C39 C44: Value: 1uF
IC3 = ADIN1100CCPZ: Integrated Circuit; Manufacturer_Name: Analog Devices; Datasheet Link: https://www.analog.com/media/en/technical-documentation/data-sheets/adin1100.pdf; Height: 0.8mm; Manufacturer_Part_Number: ADIN1100CCPZ; Mouser Part Number: 584-ADIN1100CCPZ; Mouser Price/Stock: https://www.mouser.co.uk/ProductDetail/Analog-Devices/ADIN1100CCPZ?qs=pUKx8fyJudC406QBDc8dqQ%3D%3D; Arrow Part Number: ADIN1100CCPZ; Arrow Price/Stock: https://www.arrow.com/en/products/adin1100ccpz/analog-devices?region=nac
LD3 LD4 = LED: LED generic
  LD3: Value: YELLOW
  LD4: Value: GREEN
R15-R18 R51-R59 = Resistor
  R15 R17: Value: 10k
  R16 R51-R59: Value: 4.7k
  R18: Value: 1.5k
X3 = Crystal C2.5x2 Seiko Epson FA-128: Value: 25Mhz

## Nets that join several sheets
+3V3: TopLevel (J4.11 J5.1 R78.2), MCU (32 pins), SPE_PHY (23 pins)
GND: TopLevel (10 pins), MCU (39 pins), SPE_Electronics (D5.2 D6.2), SPE_PHY (16 pins)
CABLE_N: TopLevel (C49.1 J3.1), SPE_Electronics (D4.1 R33.2 R38.2)
CABLE_P: TopLevel (C48.1 J3.2), SPE_Electronics (D3.1 R19.2 R20.2)
NetIC3_1: TopLevel (R44.1), SPE_PHY (IC3.1)
NetIC3_5: TopLevel (R39.1), SPE_PHY (IC3.5)
NetIC3_7: TopLevel (R40.1 R50.2), SPE_PHY (IC3.7)
NetIC3_26: TopLevel (R66.1), SPE_PHY (IC3.26 R18.2)
NetIC3_27: TopLevel (R65.1), SPE_PHY (IC3.27)
NetIC3_36: TopLevel (TP4.1), SPE_PHY (IC3.36)
NetIC3_37: TopLevel (R46.1), SPE_PHY (IC3.37)
NetIC3_38: TopLevel (R41.1), SPE_PHY (IC3.38)
NetIC3_39: TopLevel (R42.1), SPE_PHY (IC3.39)
NetIC3_40: TopLevel (R43.1), SPE_PHY (IC3.40)
NetR6_2: TopLevel (R72.2), MCU (R6.2)
NetR47_2: TopLevel (R47.2), MCU (R67.1)
NetR49_1: TopLevel (TP5.1), MCU (R49.1)
NRST: TopLevel (R39.2 R71.2), MCU (C15.2 S2.1 U1.25)
PA0: TopLevel (TP3.1), MCU (U1.34)
PA1: TopLevel (R40.2), MCU (R67.2 U1.35)
PA2: TopLevel (R66.2), MCU (U1.36)
PA3: TopLevel (TP2.1), MCU (U1.37)
PA7: TopLevel (R63.2), MCU (U1.43)
PA10: TopLevel (R75.2), MCU (U1.102)
PA11: TopLevel (R73.2), MCU (U1.103)
PA12: TopLevel (R74.2), MCU (U1.104)
PA13: TopLevel (R69.2), MCU (U1.105)
PA14: TopLevel (R70.2), MCU (U1.109)
PA15: TopLevel (J2.7), MCU (U1.110)
PB0: TopLevel (R61.2), MCU (U1.46)
PB1: TopLevel (R62.2), MCU (U1.47)
PB3: TopLevel (R68.2), MCU (U1.133)
PB10: TopLevel (R64.2), MCU (U1.69)
PB13: TopLevel (R43.2), MCU (U1.74)
PC1: TopLevel (R65.2), MCU (U1.27)
PC2: TopLevel (R44.2), MCU (U1.28)
PC3: TopLevel (R41.2), MCU (U1.29)
PC4: TopLevel (R48.2), MCU (U1.44)
PC5: TopLevel (R60.2), MCU (U1.45)
PC6: TopLevel (J4.3), MCU (U1.96)
PC7: TopLevel (J4.1), MCU (U1.97)
PC8: TopLevel (J4.5), MCU (U1.98)
PC9: TopLevel (J4.7), MCU (U1.99)
PC10: TopLevel (J2.5), MCU (U1.111)
PC11: TopLevel (J2.1), MCU (U1.112)
PC12: TopLevel (J2.3), MCU (U1.113)
PD8: TopLevel (J9.1), MCU (U1.77)
PD9: TopLevel (J9.2), MCU (U1.78)
PE0: TopLevel (R45.2), MCU (U1.141)
PG11: TopLevel (R46.2), MCU (U1.126)
PG13: TopLevel (R42.2), MCU (U1.128)
RX_CLK: TopLevel (R47.1), SPE_PHY (IC3.32 R54.2)
RX_DV: TopLevel (R63.1), SPE_PHY (IC3.33 R53.2)
RX_ER: TopLevel (R64.1), SPE_PHY (IC3.34 R52.2)
RXD_0: TopLevel (R48.1), SPE_PHY (IC3.31 R55.2)
RXD_1: TopLevel (R60.1), SPE_PHY (IC3.30 R56.2)
RXD_2: TopLevel (R61.1), SPE_PHY (IC3.29 R57.2)
RXD_3: TopLevel (R62.1), SPE_PHY (IC3.28 R58.2)
RXN: SPE_Electronics (R26.1 R28.1), SPE_PHY (IC3.13)
RXP: SPE_Electronics (R30.1 R31.1), SPE_PHY (IC3.14)
TXD_3: TopLevel (R45.1), SPE_PHY (IC3.2 R51.2)
TXN: SPE_Electronics (R24.1 R29.2), SPE_PHY (IC3.12)
TXP: SPE_Electronics (R27.2 R37.1), SPE_PHY (IC3.15)